# Altium project DAP.PrjPcb (part 1 of 3)
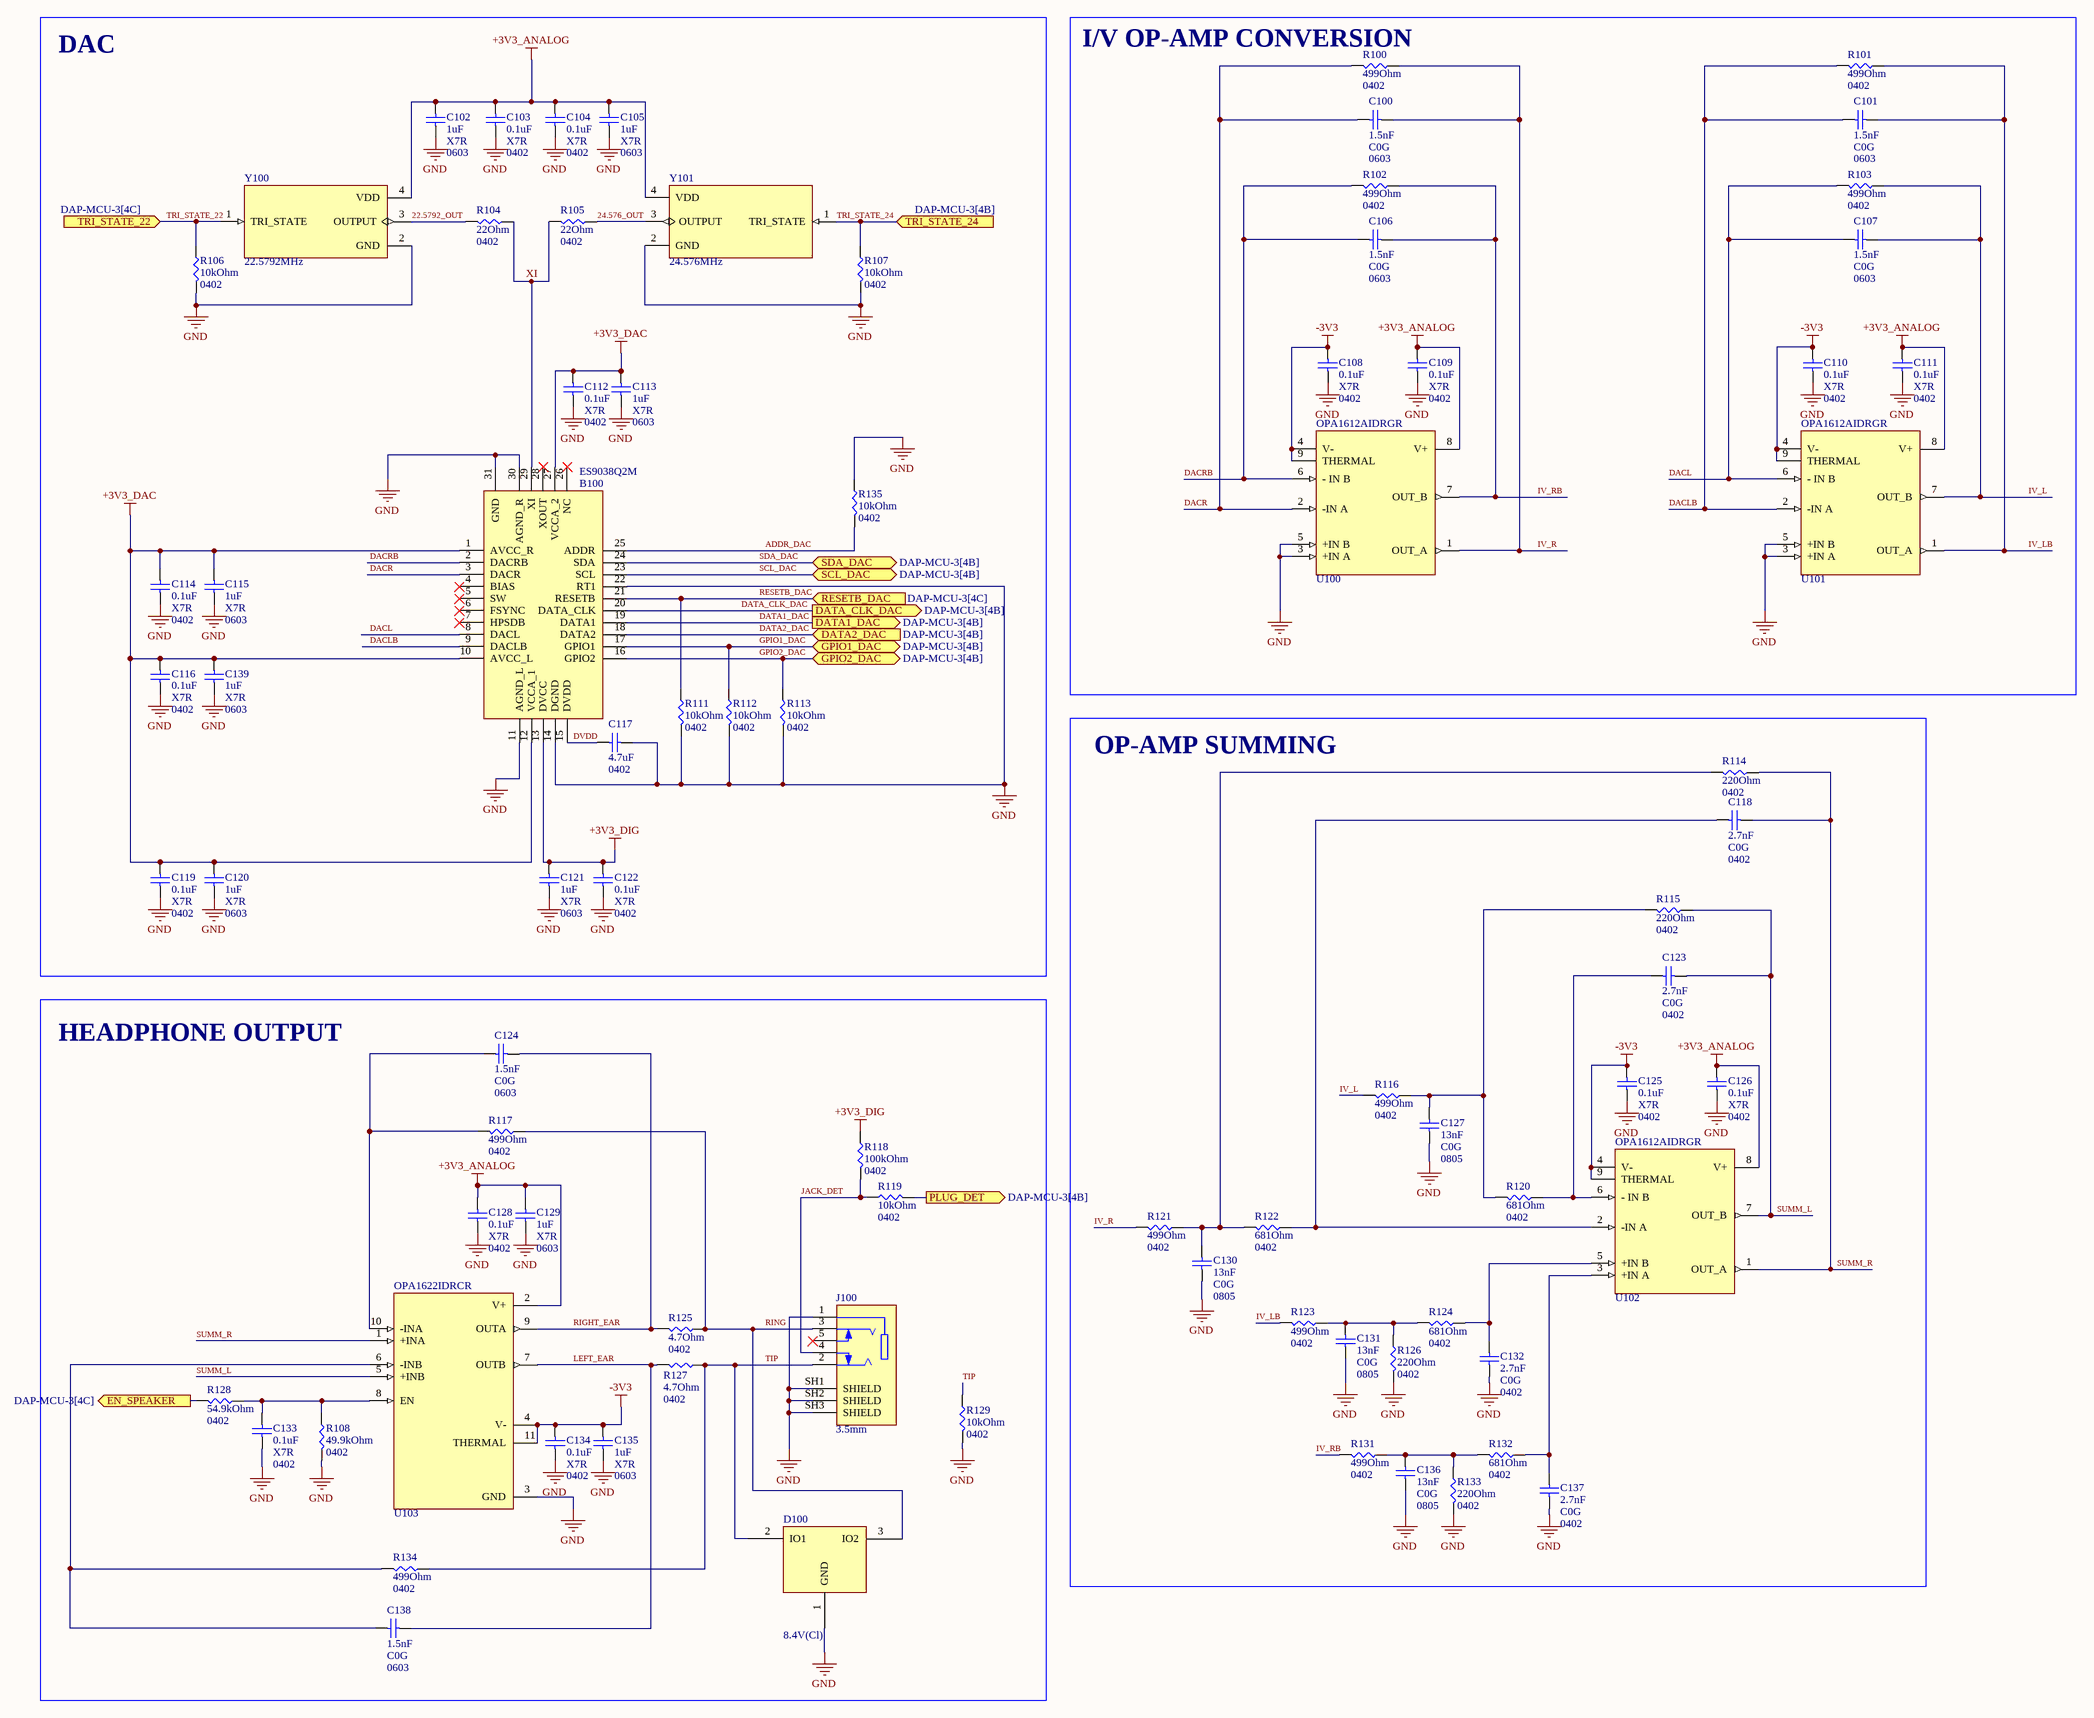
[diagram p0: DAP-Audio-1.SchDoc]
4 sheets, 270 parts. Net scope: flat (ports and power ports of the same name join across sheets).
Board file: DAP-PCB.PcbDoc
Sheets:
  DAP-Audio-1.SchDoc
  DAP-Power-2.SchDoc
  DAP-MCU-3.SchDoc
  DAP-Peripherals-4.SchDoc

## Sheet DAP-Audio-1.SchDoc
size C; SheetNumber: 1; SheetTotal: 4

### Parts
B100  DAC Audiophile  [QFN40P300X500X80-31N-D]  (value not drawn)
C100  <Value>: 1.5nF  <Spec>: C0G  <Footprint>: 0603  [CAPC1608X100N]  (hidden comment: CAP CER 1500PF 50V C0G/NP0 0603)
C101  <Value>: 1.5nF  <Spec>: C0G  <Footprint>: 0603  [CAPC1608X100N]  (hidden comment: CAP CER 1500PF 50V C0G/NP0 0603)
C102  <Value>: 1uF  <Spec>: X7R  <Footprint>: 0603  [CAPC1608X100N]  (hidden comment: CAP CER 1UF 25V X7R 0603)
C103  <Value>: 0.1uF  <Spec>: X7R  <Footprint>: 0402  [CAPC1005X60N]  (hidden comment: CAP CER 0.1UF 50V X7R 0402)
C104  <Value>: 0.1uF  <Spec>: X7R  <Footprint>: 0402  [CAPC1005X60N]  (hidden comment: CAP CER 0.1UF 50V X7R 0402)
C105  <Value>: 1uF  <Spec>: X7R  <Footprint>: 0603  [CAPC1608X100N]  (hidden comment: CAP CER 1UF 25V X7R 0603)
C106  <Value>: 1.5nF  <Spec>: C0G  <Footprint>: 0603  [CAPC1608X100N]  (hidden comment: CAP CER 1500PF 50V C0G/NP0 0603)
C107  <Value>: 1.5nF  <Spec>: C0G  <Footprint>: 0603  [CAPC1608X100N]  (hidden comment: CAP CER 1500PF 50V C0G/NP0 0603)
C108  <Value>: 0.1uF  <Spec>: X7R  <Footprint>: 0402  [CAPC1005X60N]  (hidden comment: CAP CER 0.1UF 50V X7R 0402)
C109  <Value>: 0.1uF  <Spec>: X7R  <Footprint>: 0402  [CAPC1005X60N]  (hidden comment: CAP CER 0.1UF 50V X7R 0402)
C110  <Value>: 0.1uF  <Spec>: X7R  <Footprint>: 0402  [CAPC1005X60N]  (hidden comment: CAP CER 0.1UF 50V X7R 0402)
C111  <Value>: 0.1uF  <Spec>: X7R  <Footprint>: 0402  [CAPC1005X60N]  (hidden comment: CAP CER 0.1UF 50V X7R 0402)
C112  <Value>: 0.1uF  <Spec>: X7R  <Footprint>: 0402  [CAPC1005X60N]  (hidden comment: CAP CER 0.1UF 50V X7R 0402)
C113  <Value>: 1uF  <Spec>: X7R  <Footprint>: 0603  [CAPC1608X100N]  (hidden comment: CAP CER 1UF 25V X7R 0603)
C114  <Value>: 0.1uF  <Spec>: X7R  <Footprint>: 0402  [CAPC1005X60N]  (hidden comment: CAP CER 0.1UF 50V X7R 0402)
C115  <Value>: 1uF  <Spec>: X7R  <Footprint>: 0603  [CAPC1608X100N]  (hidden comment: CAP CER 1UF 25V X7R 0603)
C116  <Value>: 0.1uF  <Spec>: X7R  <Footprint>: 0402  [CAPC1005X60N]  (hidden comment: CAP CER 0.1UF 50V X7R 0402)
C117  <Value>: 4.7uF  <Footprint>: 0402  [CAPC1005X60N]  (hidden comment: CAP CER 4.7UF 6.3V X5R 0402)
C118  <Value>: 2.7nF  <Spec>: C0G  <Footprint>: 0402  [CAPC1005X60N]  (hidden comment: CAP CER 2700PF 50V C0G/NP0 0402)
C119  <Value>: 0.1uF  <Spec>: X7R  <Footprint>: 0402  [CAPC1005X60N]  (hidden comment: CAP CER 0.1UF 50V X7R 0402)
C120  <Value>: 1uF  <Spec>: X7R  <Footprint>: 0603  [CAPC1608X100N]  (hidden comment: CAP CER 1UF 25V X7R 0603)
C121  <Value>: 1uF  <Spec>: X7R  <Footprint>: 0603  [CAPC1608X100N]  (hidden comment: CAP CER 1UF 25V X7R 0603)
C122  <Value>: 0.1uF  <Spec>: X7R  <Footprint>: 0402  [CAPC1005X60N]  (hidden comment: CAP CER 0.1UF 50V X7R 0402)
C123  <Value>: 2.7nF  <Spec>: C0G  <Footprint>: 0402  [CAPC1005X60N]  (hidden comment: CAP CER 2700PF 50V C0G/NP0 0402)
C124  <Value>: 1.5nF  <Spec>: C0G  <Footprint>: 0603  [CAPC1608X100N]  (hidden comment: CAP CER 1500PF 50V C0G/NP0 0603)
C125  <Value>: 0.1uF  <Spec>: X7R  <Footprint>: 0402  [CAPC1005X60N]  (hidden comment: CAP CER 0.1UF 50V X7R 0402)
C126  <Value>: 0.1uF  <Spec>: X7R  <Footprint>: 0402  [CAPC1005X60N]  (hidden comment: CAP CER 0.1UF 50V X7R 0402)
C127  <Value>: 13nF  <Spec>: C0G  <Footprint>: 0805  [CAP_MUR_0805]  (hidden comment: CAP CER 0.013UF 50V C0G/NP0 0805)
C128  <Value>: 0.1uF  <Spec>: X7R  <Footprint>: 0402  [CAPC1005X60N]  (hidden comment: CAP CER 0.1UF 50V X7R 0402)
C129  <Value>: 1uF  <Spec>: X7R  <Footprint>: 0603  [CAPC1608X100N]  (hidden comment: CAP CER 1UF 25V X7R 0603)
C130  <Value>: 13nF  <Spec>: C0G  <Footprint>: 0805  [CAP_MUR_0805]  (hidden comment: CAP CER 0.013UF 50V C0G/NP0 0805)
C131  <Value>: 13nF  <Spec>: C0G  <Footprint>: 0805  [CAP_MUR_0805]  (hidden comment: CAP CER 0.013UF 50V C0G/NP0 0805)
C132  <Value>: 2.7nF  <Spec>: C0G  <Footprint>: 0402  [CAPC1005X60N]  (hidden comment: CAP CER 2700PF 50V C0G/NP0 0402)
C133  <Value>: 0.1uF  <Spec>: X7R  <Footprint>: 0402  [CAPC1005X60N]  (hidden comment: CAP CER 0.1UF 50V X7R 0402)
C134  <Value>: 0.1uF  <Spec>: X7R  <Footprint>: 0402  [CAPC1005X60N]  (hidden comment: CAP CER 0.1UF 50V X7R 0402)
C135  <Value>: 1uF  <Spec>: X7R  <Footprint>: 0603  [CAPC1608X100N]  (hidden comment: CAP CER 1UF 25V X7R 0603)
C136  <Value>: 13nF  <Spec>: C0G  <Footprint>: 0805  [CAP_MUR_0805]  (hidden comment: CAP CER 0.013UF 50V C0G/NP0 0805)
C137  <Value>: 2.7nF  <Spec>: C0G  <Footprint>: 0402  [CAPC1005X60N]  (hidden comment: CAP CER 2700PF 50V C0G/NP0 0402)
C138  <Value>: 1.5nF  <Spec>: C0G  <Footprint>: 0603  [CAPC1608X100N]  (hidden comment: CAP CER 1500PF 50V C0G/NP0 0603)
C139  <Value>: 1uF  <Spec>: X7R  <Footprint>: 0603  [CAPC1608X100N]  (hidden comment: CAP CER 1UF 25V X7R 0603)
D100  <Value>: 8.4V(Cl)  [IC_ESD122DMXR]  (hidden comment: TVS DIODE 3.6VWM 8.4VC 3X2SON)
J100  <Value>: 3.5mm  [CUI_SJ1-3535NS]  (hidden comment: CONN JACK STEREO 3.5MM R/A)
R100  <Value>: 499Ohm  <Footprint>: 0402  [RESC1005X40N]  (hidden comment: RES SMD 499 OHM 0.1% 1/16W 0402)
R101  <Value>: 499Ohm  <Footprint>: 0402  [RESC1005X40N]  (hidden comment: RES SMD 499 OHM 0.1% 1/16W 0402)
R102  <Value>: 499Ohm  <Footprint>: 0402  [RESC1005X40N]  (hidden comment: RES SMD 499 OHM 0.1% 1/16W 0402)
R103  <Value>: 499Ohm  <Footprint>: 0402  [RESC1005X40N]  (hidden comment: RES SMD 499 OHM 0.1% 1/16W 0402)
R104  <Value>: 22Ohm  <Footprint>: 0402  [RESC1005X40N]  (hidden comment: RES 22 OHM 1% 1/16W 0402)
R105  <Value>: 22Ohm  <Footprint>: 0402  [RESC1005X40N]  (hidden comment: RES 22 OHM 1% 1/16W 0402)
R106  <Value>: 10kOhm  <Footprint>: 0402  [RESC1005X40N]  (hidden comment: RES SMD 10K OHM 1% 1/16W 0402)
R107  <Value>: 10kOhm  <Footprint>: 0402  [RESC1005X40N]  (hidden comment: RES SMD 10K OHM 1% 1/16W 0402)
R108  <Value>: 49.9kOhm  <Footprint>: 0402  [RESC1005X40N]  (hidden comment: RES SMD 49.9KOHM 0.1% 1/16W 0402)
R111  <Value>: 10kOhm  <Footprint>: 0402  [RESC1005X40N]  (hidden comment: RES SMD 10K OHM 1% 1/16W 0402)
R112  <Value>: 10kOhm  <Footprint>: 0402  [RESC1005X40N]  (hidden comment: RES SMD 10K OHM 1% 1/16W 0402)
R113  <Value>: 10kOhm  <Footprint>: 0402  [RESC1005X40N]  (hidden comment: RES SMD 10K OHM 1% 1/16W 0402)
R114  <Value>: 220Ohm  <Footprint>: 0402  [RESC1005X40N]  (hidden comment: RES SMD 220 OHM 0.1% 1/16W 0402)
R115  <Value>: 220Ohm  <Footprint>: 0402  [RESC1005X40N]  (hidden comment: RES SMD 220 OHM 0.1% 1/16W 0402)
R116  <Value>: 499Ohm  <Footprint>: 0402  [RESC1005X40N]  (hidden comment: RES SMD 499 OHM 0.1% 1/16W 0402)
R117  <Value>: 499Ohm  <Footprint>: 0402  [RESC1005X40N]  (hidden comment: RES SMD 499 OHM 0.1% 1/16W 0402)
R118  <Value>: 100kOhm  <Footprint>: 0402  [RESC1005X40N]  (hidden comment: RES SMD 100K OHM 0.1% 1/16W 0402)
R119  <Value>: 10kOhm  <Footprint>: 0402  [RESC1005X40N]  (hidden comment: RES SMD 10K OHM 1% 1/16W 0402)
R120  <Value>: 681Ohm  <Footprint>: 0402  [RESC1005X40N]  (hidden comment: RES SMD 681 OHM 0.1% 1/16W 0402)
R121  <Value>: 499Ohm  <Footprint>: 0402  [RESC1005X40N]  (hidden comment: RES SMD 499 OHM 0.1% 1/16W 0402)
R122  <Value>: 681Ohm  <Footprint>: 0402  [RESC1005X40N]  (hidden comment: RES SMD 681 OHM 0.1% 1/16W 0402)
R123  <Value>: 499Ohm  <Footprint>: 0402  [RESC1005X40N]  (hidden comment: RES SMD 499 OHM 0.1% 1/16W 0402)
R124  <Value>: 681Ohm  <Footprint>: 0402  [RESC1005X40N]  (hidden comment: RES SMD 681 OHM 0.1% 1/16W 0402)
R125  <Value>: 4.7Ohm  <Footprint>: 0402  [RESC1005X40N]  (hidden comment: RES SMD 4.7 OHM 0.1% 1/16W 0402)
R126  <Value>: 220Ohm  <Footprint>: 0402  [RESC1005X40N]  (hidden comment: RES SMD 220 OHM 0.1% 1/16W 0402)
R127  <Value>: 4.7Ohm  <Footprint>: 0402  [RESC1005X40N]  (hidden comment: RES SMD 4.7 OHM 0.1% 1/16W 0402)
R128  <Value>: 54.9kOhm  <Footprint>: 0402  [RESC1005X40N]  (hidden comment: RES SMD 54.9KOHM 0.1% 1/16W 0402)
R129  <Value>: 10kOhm  <Footprint>: 0402  [RESC1005X40N]  (hidden comment: RES SMD 10K OHM 1% 1/16W 0402)
R131  <Value>: 499Ohm  <Footprint>: 0402  [RESC1005X40N]  (hidden comment: RES SMD 499 OHM 0.1% 1/16W 0402)
R132  <Value>: 681Ohm  <Footprint>: 0402  [RESC1005X40N]  (hidden comment: RES SMD 681 OHM 0.1% 1/16W 0402)
R133  <Value>: 220Ohm  <Footprint>: 0402  [RESC1005X40N]  (hidden comment: RES SMD 220 OHM 0.1% 1/16W 0402)
R134  <Value>: 499Ohm  <Footprint>: 0402  [RESC1005X40N]  (hidden comment: RES SMD 499 OHM 0.1% 1/16W 0402)
R135  <Value>: 10kOhm  <Footprint>: 0402  [RESC1005X40N]  (hidden comment: RES SMD 10K OHM 1% 1/16W 0402)
U100  IC OP AMP 2CH 8-SON  [SON50P300X300X80-9N200X120]  (value not drawn)
U101  IC OP AMP 2CH 8-SON  [SON50P300X300X80-9N200X120]  (value not drawn)
U102  IC OP AMP 2CH 8-SON  [SON50P300X300X80-9N200X120]  (value not drawn)
U103  IC OP AMP 2CH 10-VSON  [IC_OPA1622IDRCR]  (value not drawn)
Y100  <Value>: 22.5792MHz  [OSC_ECS-2520MVLC-225.792-CN-TR]  (hidden comment: XTAL OSC XO 22.5792MHZ CMOS SMD)
Y101  <Value>: 24.576MHz  [XTAL_ASTX-H11-24.576MHZ-T]  (hidden comment: XTAL OSC TCXO 24.5760MHZ HCMOS)

### Blocks framed on the sheet
DAC: B100 C102-C105 C112-C117 C119-C122 C139 R104-R107 R111-R113 R135 Y100 Y101
I/V OP-AMP CONVERSION: C100 C101 C106-C111 R100-R103 U100 U101
OP-AMP SUMMING: C118 C123 C125-C127 C130-C132 C136 C137 R114-R116 R120-R124 R126 R131-R133 U102
HEADPHONE OUTPUT: C124 C128 C129 C133-C135 C138 D100 J100 R108 R117-R119 R125 R127-R129 R134 U103

### Ports
DATA1_DAC (out, see DAP-MCU-3[4B]), DATA2_DAC (in, see DAP-MCU-3[4B]), DATA_CLK_DAC (out, see DAP-MCU-3[4B]), EN_SPEAKER (out, see DAP-MCU-3[4C]), GPIO1_DAC (bidir, see DAP-MCU-3[4B]), GPIO2_DAC (bidir, see DAP-MCU-3[4B]), PLUG_DET (out, see DAP-MCU-3[4B]), RESETB_DAC (in, see DAP-MCU-3[4C]), SCL_DAC (bidir, see DAP-MCU-3[4B]), SDA_DAC (bidir, see DAP-MCU-3[4B]), TRI_STATE_22 (in, see DAP-MCU-3[4C]), TRI_STATE_24 (in, see DAP-MCU-3[4B])

### Nets
+3V3_ANALOG: C102.2 C103.2 C104.2 C105.2 C109.2 C111.2 C126.2 C128.2 C129.2 U100.8(V+) U101.8(V+) U102.8(V+) U103.2(V+) Y100.4(VDD) Y101.4(VDD)
+3V3_DAC: B100.1(AVCC_R) B100.10(AVCC_L) B100.12(VCCA_1) B100.27(VCCA_2) C112.2 C113.2 C114.2 C115.2 C116.2 C119.2 C120.2 C139.2
+3V3_DIG: B100.13(DVCC) C121.2 C122.2 R118.2
-3V3: C108.2 C110.2 C125.2 C134.2 C135.2 U100.4(V-) U100.9(THERMAL) U101.4(V-) U101.9(THERMAL) U102.4(V-) U102.9(THERMAL) U103.4(V-) U103.11(THERMAL)
GND: B100.11(AGND_L) B100.14(DGND) B100.22(RT1) B100.30(AGND_R) B100.31(GND) C102.1 C103.1 C104.1 C105.1 C108.1 C109.1 C110.1 C111.1 C112.1 C113.1 C114.1 C115.1 C116.1 C117.1 C119.1 C120.1 C121.1 C122.1 C125.1 C126.1 C127.1 C128.1 C129.1 C130.1 C131.1 C132.2 C133.1 C134.1 C135.1 C136.1 C137.2 C139.1 D100.1(GND) J100.1 J100.SH1(SHIELD) J100.SH2(SHIELD) J100.SH3(SHIELD) R106.1 R107.1 R108.1 R111.1 R112.1 R113.1 R126.1 R129.1 R133.1 R135.2 U100.3(+IN_A) U100.5(+IN_B) U101.3(+IN_A) U101.5(+IN_B) U103.3(GND) Y100.2(GND) Y101.2(GND)
22.5792_OUT: R104.1 Y100.3(OUTPUT)
24.576_OUT: R105.2 Y101.3(OUTPUT)
ADDR_DAC: B100.25(ADDR) R135.1
DACL: B100.8(DACL) C107.2 R103.1 U101.6(-_IN_B)
DACLB: B100.9(DACLB) C101.2 R101.1 U101.2(-IN_A)
DACR: B100.3(DACR) C100.2 R100.1 U100.2(-IN_A)
DACRB: B100.2(DACRB) C106.2 R102.1 U100.6(-_IN_B)
DATA1_DAC: B100.19(DATA1) ; port DATA1_DAC
DATA2_DAC: B100.18(DATA2) ; port DATA2_DAC
DATA_CLK_DAC: B100.20(DATA_CLK) ; port DATA_CLK_DAC
DVDD: B100.15(DVDD) C117.2
GPIO1_DAC: B100.17(GPIO1) R112.2 ; port GPIO1_DAC
GPIO2_DAC: B100.16(GPIO2) R113.2 ; port GPIO2_DAC
IV_L: C107.1 R103.2 R116.1 U101.7(OUT_B)
IV_LB: C101.1 R101.2 R123.1 U101.1(OUT_A)
IV_R: C100.1 R100.2 R121.1 U100.1(OUT_A)
IV_RB: C106.1 R102.2 R131.1 U100.7(OUT_B)
JACK_DET: J100.4 R118.1 R119.2
LEFT_EAR: C138.1 R127.1 U103.7(OUTB)
RESETB_DAC: B100.21(RESETB) R111.2 ; port RESETB_DAC
RIGHT_EAR: C124.1 R125.1 U103.9(OUTA)
RING: D100.3(IO2) J100.3 R117.2 R125.2
SCL_DAC: B100.23(SCL) ; port SCL_DAC  [project net SCL_BQ]
SDA_DAC: B100.24(SDA) ; port SDA_DAC  [project net SDA_BQ]
SUMM_L: C123.1 R115.2 U102.7(OUT_B) U103.5(+INB)
SUMM_R: C118.1 R114.2 U102.1(OUT_A) U103.1(+INA)
TIP: D100.2(IO1) J100.2 R127.2 R129.2 R134.2
TRI_STATE_22: R106.2 Y100.1(TRI_STATE) ; port TRI_STATE_22
TRI_STATE_24: R107.2 Y101.1(TRI_STATE) ; port TRI_STATE_24
XI: B100.29(XI) R104.2 R105.1
NetC118_2: C118.2 R122.2 U102.2(-IN_A)
NetC123_2: C123.2 R120.2 U102.6(-_IN_B)
NetC124_2: C124.2 R117.1 U103.10(-INA)
NetC127_2: C127.2 R115.1 R116.2 R120.1
NetC130_2: C130.2 R114.1 R121.2 R122.1
NetC131_2: C131.2 R123.2 R124.1 R126.2
NetC132_1: C132.1 R124.2 U102.5(+IN_B)
NetC133_2: C133.2 R108.2 R128.2 U103.8(EN)
NetC136_2: C136.2 R131.2 R132.1 R133.2
NetC137_1: C137.1 R132.2 U102.3(+IN_A)
NetC138_2: C138.2 R134.1 U103.6(-INB)
NetR119_1: R119.1 ; port PLUG_DET
NetR128_1: R128.1 ; port EN_SPEAKER

Not connected (* = marked no-connect by the designer): B100 4(BIAS)* 5(SW)* 6(FSYNC)* 7(HPSDB)* 26(NC)* 28(XOUT)*; J100 5*

### Library data of the parts
B100 = #1-053: Manufacturer_Name: ESS Technology; Geometry.Height: 0.8mm; AL-PN: #1-053; <Termination>: SMD; Creator Project: DAP; Lead Time: 9 Weeks; Mouser Part Number: 460-ES9038Q2M; Mouser Price/Stock: https://www.mouser.co.uk/ProductDetail/ESS-Technology/ES9038Q2M?qs=sPbYRqrBIVmdeUedURuuOw%3D%3D; Manufacturer_Part_Number: ES9038Q2M; Datasheet Link: *; PartType: IC; SubType: DAC; Status: Verified; Supplier 1: Mouser; Supplier Label: Audio D/A Converter ICs Sabre 32 Reference Stereo low power audiophile DAC w/DOP; Supplier Part Number 1: 460-ES9038Q2M; Type: Standard; Manufacturer 1: ESS Technology; Manufacturer Part Number 1: ES9038Q2M
C100 C101 C106 C107 C124 C138 = #1-106: Manufacturer 1: Murata Electronics; Manufacturer Part Number 1: GCM1885C1H152FA16D; AL-PN: #1-106; SubType: Ceramic; <Tolerance>: 0.01; <Termination>: SMD; Creator Project: DAP; Type: Standard; Lead Time: 21 Weeks; PartType: Capacitor; <Rating>: 50V; Status: Verified; Supplier 1: Digikey; Supplier Label: 1500 pF ±1% 50V Ceramic Capacitor C0G, NP0 0603 (1608 Metric); Supplier Part Number 1: 490-18206-1-ND
C102 C105 C113 C115 C120 C121 C129 C135 C139 = #1-132: Manufacturer 1: Murata Electronics; Manufacturer Part Number 1: GCM188R71E105KA64D; AL-PN: #1-132; SubType: Ceramic; <Tolerance>: 0.1; <Termination>: SMD; Creator Project: DAP; Type: Standard; Lead Time: 21 Weeks; PartType: Capacitor; <Rating>: 25V; Status: Verified; Supplier 1: Digikey; Supplier Label: 1 µF ±10% 25V Ceramic Capacitor X7R 0603 (1608 Metric); Supplier Part Number 1: 490-10673-1-ND
C103 C104 C108-C112 C114 C116 C119 C122 C125 C126 C128 C133 C134 = #1-080: Manufacturer 1: Murata Electronics; Manufacturer Part Number 1: GCM155R71H104KE02D; AL-PN: #1-080; SubType: Ceramic; <Tolerance>: 0.1; <Termination>: SMD; Creator Project: DAP; Type: Standard; Lead Time: 21 Weeks; PartType: Capacitor; <Rating>: 50V; Status: Verified; Supplier 1: Digikey; Supplier Label: 0.1 µF ±10% 50V Ceramic Capacitor X7R 0402 (1005 Metric); Supplier Part Number 1: 490-10672-1-ND
C117 = #1-103: Manufacturer 1: Murata Electronics; Manufacturer Part Number 1: GRM155R60J475ME47D; AL-PN: #1-103; SubType: Ceramic; <Tolerance>: 0.2; <Termination>: SMD; Creator Project: DAP; Type: Standard; Lead Time: 17 Weeks; PartType: Capacitor; <Rating>: 6.3V; Status: Verified; Supplier 1: Digikey; Supplier Label: 4.7 µF ±20% 6.3V Ceramic Capacitor X5R 0402 (1005 Metric); Supplier Part Number 1: 490-5915-1-ND
C118 C123 C132 C137 = #1-107: Manufacturer 1: Murata Electronics; Manufacturer Part Number 1: GRM1555C1H272GE01D; AL-PN: #1-107; SubType: Ceramic; <Tolerance>: 0.02; <Termination>: SMD; Creator Project: DAP; Type: Standard; Lead Time: 17 Weeks; PartType: Capacitor; <Rating>: 50V; Status: Verified; Supplier 1: Digikey; Supplier Label: 2700 pF ±2% 50V Ceramic Capacitor C0G, NP0 0402 (1005 Metric); Supplier Part Number 1: 490-GRM1555C1H272GE01DCT-ND
C127 C130 C131 C136 = #1-108: Manufacturer 1: Murata Electronics; Manufacturer Part Number 1: GRM2195C1H133JA01D; AL-PN: #1-108; SubType: Ceramic; <Tolerance>: 0.05; <Termination>: SMD; Creator Project: DAP; Type: Standard; Lead Time: 17 Weeks; PartType: Capacitor; <Rating>: 50V; Status: Verified; Supplier 1: Digikey; Supplier Label: 0.013 µF ±5% 50V Ceramic Capacitor C0G, NP0 0805 (2012 Metric); Supplier Part Number 1: 490-12752-1-ND
D100 = #1-112: Manufacturer 1: Texas Instruments; Manufacturer Part Number 1: ESD122DMXR; AL-PN: #1-112; <Rating>: 0.2pF; <Termination>: SMD; Creator Project: DAP; Type: Standard; Lead Time: 9 Weeks; PartType: Diode; SubType: TVS; Status: Verified; Supplier 1: Digikey; Supplier Label: 8.4V (Typ) Clamp 2.5A (8/20µs) Ipp Tvs Diode Surface Mount 3-X2SON (1x0.6); Supplier Part Number 1: 296-48543-1-ND
J100 = #1-111: MF: Same Sky; AL-PN: #1-111; SubType: Audio; <Termination>: Thru; Creator Project: DAP; Lead Time: 19 Weeks; SnapEDA_Link: https://www.snapeda.com/parts/SJ1-3535NS/Same+Sky/view-part/?ref=snap; Package: None; Value: *; MP: SJ1-3535NS; Check_prices: https://www.snapeda.com/parts/SJ1-3535NS/Same+Sky/view-part/?ref=eda; PartType: Connector; Status: Verified; Supplier 1: Digikey; Supplier Label: 3.50mm (0.141", 1/8", Mini Plug) - Headphone Phone Jack Stereo (3 Conductor, TRS) Connector Solder; Supplier Part Number 1: CP1-3535NS-ND; Type: Standard; Manufacturer 1: Same Sky; Manufacturer Part Number 1: SJ1-3535NS
R100-R103 R116 R117 R121 R123 R131 R134 = #1-105: Manufacturer 1: YAGEO; Manufacturer Part Number 1: RT0402BRD07499RL; AL-PN: #1-105; <Tolerance>: 0.001; Creator Project: DAP; Lead Time: 23 Weeks; PartType: Resistor; <Rating>: 1/16W; <Termination>: SMD; Status: Verified; Supplier 1: Digikey; Supplier Label: 499 Ohms ±0.1% 0.063W, 1/16W Chip Resistor 0402 (1005 Metric) Thin Film; Supplier Part Number 1: YAG1440CT-ND; Type: Standard
R104 R105 = #1-102: Manufacturer 1: YAGEO; Manufacturer Part Number 1: RC0402FR-0722RL; AL-PN: #1-102; <Tolerance>: 0.01; <Termination>: SMD; Creator Project: DAP; Lead Time: 22 Weeks; PartType: Resistor; <Rating>: 1/16W; Status: Verified; Supplier 1: Digikey; Supplier Label: 22 Ohms ±1% 0.063W, 1/16W Chip Resistor 0402 (1005 Metric) Moisture Resistant Thick Film; Supplier Part Number 1: 311-22.0LRCT-ND; Type: Standard
R106 R107 R111-R113 R119 R129 R135 = #1-134: Manufacturer 1: YAGEO; Manufacturer Part Number 1: AC0402FR-0710KL; AL-PN: #1-134; <Tolerance>: 0.01; Creator Project: DAP; Lead Time: 22 Weeks; PartType: Resistor; <Termination>: SMD; Status: Verified; Supplier 1: Digikey; Supplier Label: 10 kOhms ±1% 0.063W, 1/16W Chip Resistor 0402 (1005 Metric) Automotive AEC-Q200, Moisture Resistant Thick Film; Supplier Part Number 1: YAG3436CT-ND; Type: Standard
R108 = #1-138: Manufacturer 1: YAGEO; Manufacturer Part Number 1: RT0402BRD0749K9L; AL-PN: #1-138; <Tolerance>: 0.001; Creator Project: DAP; Lead Time: 23 Weeks; PartType: Resistor; <Termination>: SMD; Status: Verified; Supplier 1: Digikey; Supplier Label: 49.9 kOhms ±0.1% 0.063W, 1/16W Chip Resistor 0402 (1005 Metric) Thin Film; Supplier Part Number 1: YAG4270CT-ND; Type: Standard
R114 R115 R126 R133 = #1-109: Manufacturer 1: YAGEO; Manufacturer Part Number 1: RT0402BRD07220RL; AL-PN: #1-109; <Tolerance>: 0.001; Creator Project: DAP; Lead Time: 23 Weeks; PartType: Resistor; <Rating>: 1/16W; <Termination>: SMD; Status: Verified; Supplier 1: Digikey; Supplier Label: 220 Ohms ±0.1% 0.063W, 1/16W Chip Resistor 0402 (1005 Metric) Thin Film; Supplier Part Number 1: YAG4207CT-ND; Type: Standard
R118 = #1-131: Manufacturer 1: YAGEO; Manufacturer Part Number 1: RT0402BRD07100KL; AL-PN: #1-131; <Tolerance>: 0.01; Creator Project: DAP; Lead Time: 23 Weeks; PartType: Resistor; <Termination>: SMD; Status: Verified; Supplier 1: Digikey; Supplier Label: 100 kOhms ±0.1% 0.063W, 1/16W Chip Resistor 0402 (1005 Metric) Thin Film; Supplier Part Number 1: YAG1343CT-ND; Type: Standard
R120 R122 R124 R132 = #1-110: Manufacturer 1: YAGEO; Manufacturer Part Number 1: RT0402BRD07681RL; AL-PN: #1-110; <Tolerance>: 0.001; Creator Project: DAP; Lead Time: 23 Weeks; PartType: Resistor; <Rating>: 1/16W; <Termination>: SMD; Status: Verified; Supplier 1: Digikey; Supplier Label: 681 Ohms ±0.1% 0.063W, 1/16W Chip Resistor 0402 (1005 Metric) Thin Film; Supplier Part Number 1: YAG1466CT-ND; Type: Standard
R125 R127 = #1-113: Manufacturer 1: YAGEO; Manufacturer Part Number 1: RT0402BRE074R7L; AL-PN: #1-113; <Tolerance>: 0.001; Creator Project: DAP; Lead Time: 23 Weeks; PartType: Resistor; <Rating>: 1/16W; <Termination>: SMD; Status: Verified; Supplier 1: Digikey; Supplier Label: 4.7 Ohms ±0.1% 0.063W, 1/16W Chip Resistor 0402 (1005 Metric) Thin Film; Supplier Part Number 1: 13-RT0402BRE074R7LCT-ND; Type: Standard
R128 = #1-079: Manufacturer 1: YAGEO; Manufacturer Part Number 1: RT0402BRD0754K9L; AL-PN: #1-079; <Tolerance>: 0.001; Creator Project: DAP; Lead Time: 20 Weeks; PartType: Resistor; <Rating>: 1/16W; <Termination>: SMD; Status: Verified; Supplier 1: Digikey; Supplier Label: 54.9 kOhms ±0.1% 0.063W, 1/16W Chip Resistor 0402 (1005 Metric) Thin Film; Supplier Part Number 1: YAG1452CT-ND; Type: Standard
U100-U102 = #1-104: Manufacturer 1: Texas Instruments; AL-PN: #1-104; SubType: Op-Amp; <Termination>: SMD; Creator Project: DAP; Lead Time: 16 Weeks; PartType: IC; Status: Verified; Supplier 1: Digikey; Supplier Label: Audio Amplifier 2 Circuit Rail-to-Rail 8-SON (3x3); Supplier Part Number 1: 296-38367-1-ND; Type: Standard; Manufacturer Part Number 1: OPA1612AIDRGR
U103 = #1-056: MF: Texas Instruments; AL-PN: #1-056; SubType: Op-Amp; <Termination>: SMD; Creator Project: DAP; Lead Time: 16 Weeks; SnapEDA_Link: https://www.snapeda.com/parts/OPA1622IDRCR/Texas+Instruments/view-part/?ref=snap; Package: VSON-10 Texas Instruments; Value: *; MP: OPA1622IDRCR; Check_prices: https://www.snapeda.com/parts/OPA1622IDRCR/Texas+Instruments/view-part/?ref=eda; PartType: IC; Status: Verified; Supplier 1: Digikey; Supplier Label: Audio Amplifier 2 Circuit 10-VSON (3x3); Supplier Part Number 1: 296-45038-1-ND; Type: Standard; Manufacturer 1: Texas Instruments; Manufacturer Part Number 1: OPA1622IDRCR
Y100 = #1-100: Manufacturer 1: ECS Inc.; Manufacturer Part Number 1: ECS-2520MVLC-225.792-CN-TR; MP: ASTX-H11-24.576MHZ-T; AL-PN: #1-100; SubType: Crystal; <Rating>: 2.2mA; Creator Project: DAP; Lead Time: 19 Weeks; Price: None; Package: None; Value: *; Availability: Unavailable; PartType: Oscillator; <Termination>: SMD; Status: Verified; Supplier 1: Digikey; Supplier Label: 22.5792 MHz XO (Standard) CMOS Oscillator 1.6V ~ 3.6V Enable/Disable 4-SMD, No Lead; Supplier Part Number 1: 50-ECS-2520MVLC-225.792-CN-TRCT-ND; Type: Standard
Y101 = #1-101: Manufacturer 1: Abracon LLC; MP: ASTX-H11-24.576MHZ-T; AL-PN: #1-101; SubType: Crystal; <Rating>: 5.5mA; <Termination>: SMD; Creator Project: DAP; Lead Time: 16 Weeks; Price: None; Package: None; Value: *; Availability: Unavailable; PartType: Oscillator; Status: Verified; Supplier 1: Digikey; Supplier Label: 24.576 MHz TCXO HCMOS Oscillator 3.3V Enable/Disable 4-SMD, No Lead; Supplier Part Number 1: 535-12038-1-ND; Type: Standard; Manufacturer Part Number 1: ASTX-H11-24.576MHZ-T